# Altium schematic sheet MPU6050.SchDoc
size A4
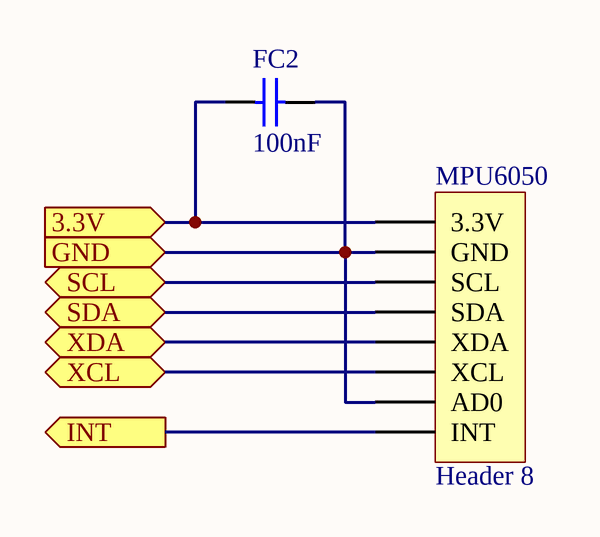
[diagram p0: MPU6050.SchDoc]

## Parts
FC2  100nF  [RAD-0.3]
MPU6050  Header 8  [HDR1X8]

## Ports
3.3V (in), GND (in), INT (out), SCL (bidir), SDA (bidir), XCL (bidir), XDA (bidir)

## Nets
3.3V: FC2.1 MPU6050.1(3.3V) ; port 3.3V
GND: FC2.2 MPU6050.2(GND) MPU6050.7(AD0) ; port GND
INT: MPU6050.8(INT) ; port INT
SCL: MPU6050.3(SCL) ; port SCL
SDA: MPU6050.4(SDA) ; port SDA
XCL: MPU6050.6(XCL) ; port XCL
XDA: MPU6050.5(XDA) ; port XDA

## Library data of the parts
FC2 = Cap: Capacitor; Published: 8-Jun-2000; LatestRevisionDate: 17-Jul-2002; LatestRevisionNote: Re-released for DXP Platform.; PackageReference: RAD-0.3; Publisher: Altium Limited; PackageDescription: Radial Cap, Thru-Hole; 2 Leads; 0.3 in Pin Spacing; Value: 100nF
MPU6050 = Header 8: Header, 8-Pin; LatestRevisionDate: 17-Jul-2002; LatestRevisionNote: Re-released for DXP Platform.; Publisher: Altium Limited